# Altium schematic sheet rf_power.SchDoc
size 381 x 241 mm; SheetNumber: 2; SheetTotal: 17
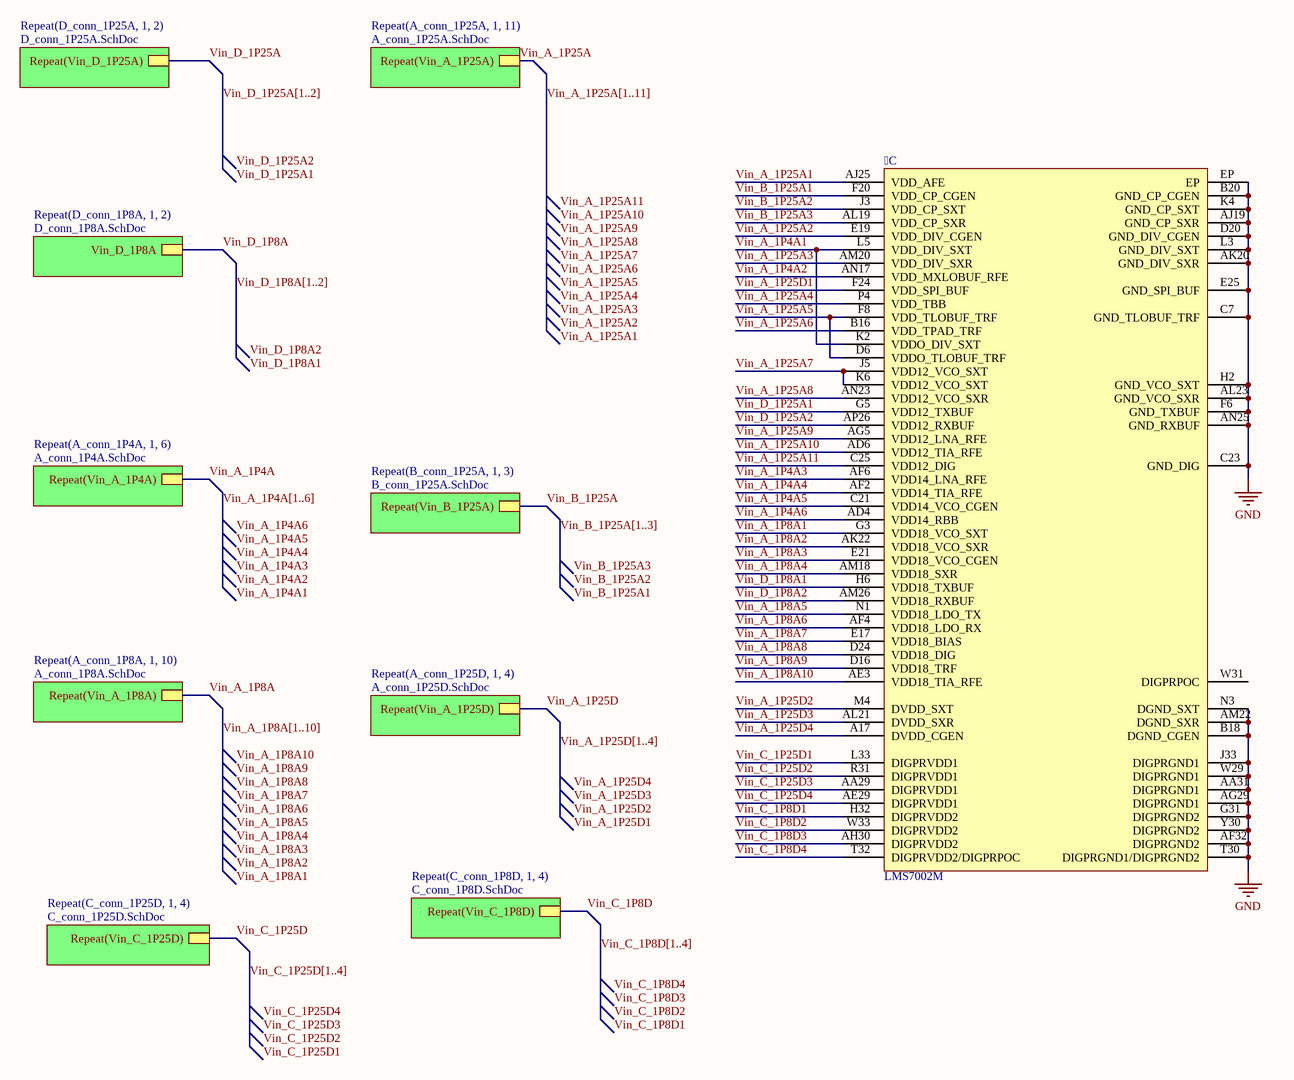
[diagram p0: rf_power.SchDoc]

## Parts
  LMS7002M  [LM-QFN-261_V]  (part C of 4)

## Sub-sheets
Repeat(A_conn_1P4A, 1, 6) = A_conn_1P4A.SchDoc: Repeat(Vin_A_1P4A)
Repeat(A_conn_1P8A, 1, 10) = A_conn_1P8A.SchDoc: Repeat(Vin_A_1P8A)
Repeat(A_conn_1P25A, 1, 11) = A_conn_1P25A.SchDoc: Repeat(Vin_A_1P25A)
Repeat(A_conn_1P25D, 1, 4) = A_conn_1P25D.SchDoc: Repeat(Vin_A_1P25D)
Repeat(B_conn_1P25A, 1, 3) = B_conn_1P25A.SchDoc: Repeat(Vin_B_1P25A)
Repeat(C_conn_1P8D, 1, 4) = C_conn_1P8D.SchDoc: Repeat(Vin_C_1P8D)
Repeat(C_conn_1P25D, 1, 4) = C_conn_1P25D.SchDoc: Repeat(Vin_C_1P25D)
Repeat(D_conn_1P8A, 1, 2) = D_conn_1P8A.SchDoc: Vin_D_1P8A
Repeat(D_conn_1P25A, 1, 2) = D_conn_1P25A.SchDoc: Repeat(Vin_D_1P25A)

## Nets
GND: .AA31(DIGPRGND1) .AF32(DIGPRGND2) .AG29(DIGPRGND1) .AJ19(GND_CP_SXR) .AK20(GND_DIV_SXR) .AL23(GND_VCO_SXR) .AM22(DGND_SXR) .AN25(GND_RXBUF) .B18(DGND_CGEN) .B20(GND_CP_CGEN) .C7(GND_TLOBUF_TRF) .C23(GND_DIG) .D20(GND_DIV_CGEN) .E25(GND_SPI_BUF) .EP .F6(GND_TXBUF) .G31(DIGPRGND2) .H2(GND_VCO_SXT) .J33(DIGPRGND1) .K4(GND_CP_SXT) .L3(GND_DIV_SXT) .N3(DGND_SXT) .T30(DIGPRGND1/DIGPRGND2) .W29(DIGPRGND1) .Y30(DIGPRGND2)
Vin_A_1P4A: sheet Repeat(A_conn_1P4A, 1, 6)/Repeat(Vin_A_1P4A)
Vin_A_1P4A1: .K2(VDDO_DIV_SXT) .L5(VDD_DIV_SXT)
Vin_A_1P4A2: .AN17(VDD_MXLOBUF_RFE)
Vin_A_1P4A3: .AF6(VDD14_LNA_RFE)
Vin_A_1P4A4: .AF2(VDD14_TIA_RFE)
Vin_A_1P4A5: .C21(VDD14_VCO_CGEN)
Vin_A_1P4A6: .AD4(VDD14_RBB)
Vin_A_1P8A: sheet Repeat(A_conn_1P8A, 1, 10)/Repeat(Vin_A_1P8A)
Vin_A_1P8A1: .G3(VDD18_VCO_SXT)
Vin_A_1P8A2: .AK22(VDD18_VCO_SXR)
Vin_A_1P8A3: .E21(VDD18_VCO_CGEN)
Vin_A_1P8A4: .AM18(VDD18_SXR)
Vin_A_1P8A5: .N1(VDD18_LDO_TX)
Vin_A_1P8A6: .AF4(VDD18_LDO_RX)
Vin_A_1P8A7: .E17(VDD18_BIAS)
Vin_A_1P8A8: .D24(VDD18_DIG)
Vin_A_1P8A9: .D16(VDD18_TRF)
Vin_A_1P8A10: .AE3(VDD18_TIA_RFE)
Vin_A_1P25A: sheet Repeat(A_conn_1P25A, 1, 11)/Repeat(Vin_A_1P25A)
Vin_A_1P25A1: .AJ25(VDD_AFE)
Vin_A_1P25A2: .E19(VDD_DIV_CGEN)
Vin_A_1P25A3: .AM20(VDD_DIV_SXR)
Vin_A_1P25A4: .P4(VDD_TBB)
Vin_A_1P25A5: .D6(VDDO_TLOBUF_TRF) .F8(VDD_TLOBUF_TRF)
Vin_A_1P25A6: .B16(VDD_TPAD_TRF)
Vin_A_1P25A7: .J5(VDD12_VCO_SXT) .K6(VDD12_VCO_SXT)
Vin_A_1P25A8: .AN23(VDD12_VCO_SXR)
Vin_A_1P25A9: .AG5(VDD12_LNA_RFE)
Vin_A_1P25A10: .AD6(VDD12_TIA_RFE)
Vin_A_1P25A11: .C25(VDD12_DIG)
Vin_A_1P25D: sheet Repeat(A_conn_1P25D, 1, 4)/Repeat(Vin_A_1P25D)
Vin_A_1P25D1: .F24(VDD_SPI_BUF)
Vin_A_1P25D2: .M4(DVDD_SXT)
Vin_A_1P25D3: .AL21(DVDD_SXR)
Vin_A_1P25D4: .A17(DVDD_CGEN)
Vin_B_1P25A: sheet Repeat(B_conn_1P25A, 1, 3)/Repeat(Vin_B_1P25A)
Vin_B_1P25A1: .F20(VDD_CP_CGEN)
Vin_B_1P25A2: .J3(VDD_CP_SXT)
Vin_B_1P25A3: .AL19(VDD_CP_SXR)
Vin_C_1P8D: sheet Repeat(C_conn_1P8D, 1, 4)/Repeat(Vin_C_1P8D)
Vin_C_1P8D1: .H32(DIGPRVDD2)
Vin_C_1P8D2: .W33(DIGPRVDD2)
Vin_C_1P8D3: .AH30(DIGPRVDD2)
Vin_C_1P8D4: .T32(DIGPRVDD2/DIGPRPOC)
Vin_C_1P25D: sheet Repeat(C_conn_1P25D, 1, 4)/Repeat(Vin_C_1P25D)
Vin_C_1P25D1: .L33(DIGPRVDD1)
Vin_C_1P25D2: .R31(DIGPRVDD1)
Vin_C_1P25D3: .AA29(DIGPRVDD1)
Vin_C_1P25D4: .AE29(DIGPRVDD1)
Vin_D_1P8A: sheet Repeat(D_conn_1P8A, 1, 2)/Vin_D_1P8A
Vin_D_1P8A1: .H6(VDD18_TXBUF)
Vin_D_1P8A2: .AM26(VDD18_RXBUF)
Vin_D_1P25A: sheet Repeat(D_conn_1P25A, 1, 2)/Repeat(Vin_D_1P25A)
Vin_D_1P25A1: .G5(VDD12_TXBUF)
Vin_D_1P25A2: .AP26(VDD12_RXBUF)

Not connected (* = marked no-connect by the designer):  W31(DIGPRPOC)

## Buses and harness runs
bus Vin_A_1P4A[1..6]
bus Vin_A_1P8A[1..10]
bus Vin_A_1P25A[1..11]
bus Vin_A_1P25D[1..4]
bus Vin_B_1P25A[1..3]
bus Vin_C_1P8D[1..4]
bus Vin_C_1P25D[1..4]
bus Vin_D_1P8A[1..2]
bus Vin_D_1P25A[1..2]

## Notes on the sheet
- Labels drawn without touching a wire or pin: Vin_A_1P4A1, Vin_A_1P4A2, Vin_A_1P4A3, Vin_A_1P4A4, Vin_A_1P4A5, Vin_A_1P4A6, Vin_A_1P8A1, Vin_A_1P8A3, Vin_A_1P8A4, Vin_A_1P8A5, Vin_A_1P8A6, Vin_A_1P8A7, Vin_A_1P8A8, Vin_A_1P8A9, Vin_A_1P8A10, Vin_A_1P25A1, Vin_A_1P25A2, Vin_A_1P25A3, Vin_A_1P25A4, Vin_A_1P25A5, Vin_A_1P25A6, Vin_A_1P25A7, Vin_A_1P25A8, Vin_A_1P25A9, Vin_A_1P25A10, Vin_A_1P25A11, Vin_A_1P25D1, Vin_A_1P25D2, Vin_A_1P25D3, Vin_A_1P25D4, Vin_B_1P25A1, Vin_B_1P25A2, Vin_B_1P25A3, Vin_C_1P8D1, Vin_C_1P8D2, Vin_C_1P8D3, Vin_C_1P8D4, Vin_C_1P25D1, Vin_C_1P25D2, Vin_C_1P25D3, Vin_C_1P25D4, Vin_D_1P8A1, Vin_D_1P25A1

## Library data of the parts
 = CMP-2000-06561-1: FPRF MIMO Transceiver IC with Integrated Microcontroller, 1.1 to 1.89 V, -40 to 85 degC, 261-Pin QFN, RoHS; Manufacturer: LimeMicrosystemsLtd; Current - Receiving: 420mA; Protocol: CDMA,GSM,HSPA,LTE,TD-SCDMA,WCDMA; Frequency: 100kHz~3.8GHz; Current - Transmitting: 350mA; Memory Size: 10kBSRAM; Power - Output: 0dBm; Serial Interfaces: SPI; RF Family/Standard: Cellular; Voltage - Supply: 1.1V~1.89V; GPIO: -; Data Rate (Max): -; Family: RFTransceiverICs; Modulation: -; Mounting Technology: SurfaceMount; Datasheet URL: http://www.richardsonrfpd.com/resources/RellDocuments/SYS_31/LMS7002M.pdf; Package Description: 261-Pin Quad Flat No-lead Package, Body 11.5 x 11.5 mm, Pitch 0.666 mm; Series: -; Sensitivity: -; Category: RF/IFandRFID; Package Reference: QFN-261; Package / Case: 261-SMDModule; Package URL: http://cdn.limemicro.com/wp-content/uploads/2015/08/LMS7002M-PCB-Layout-Recommendations-1.0r5.pdf; Operating Temperature: -40°C~85°C; Manufacturer URL: http://www.limemicro.com/; Packaging: Tray; Datasheet Version: Rev. 2.8.0, 09/2015; Type: TxRx+MCU